# EAGLE design left board (EAGLE 8.6.1)
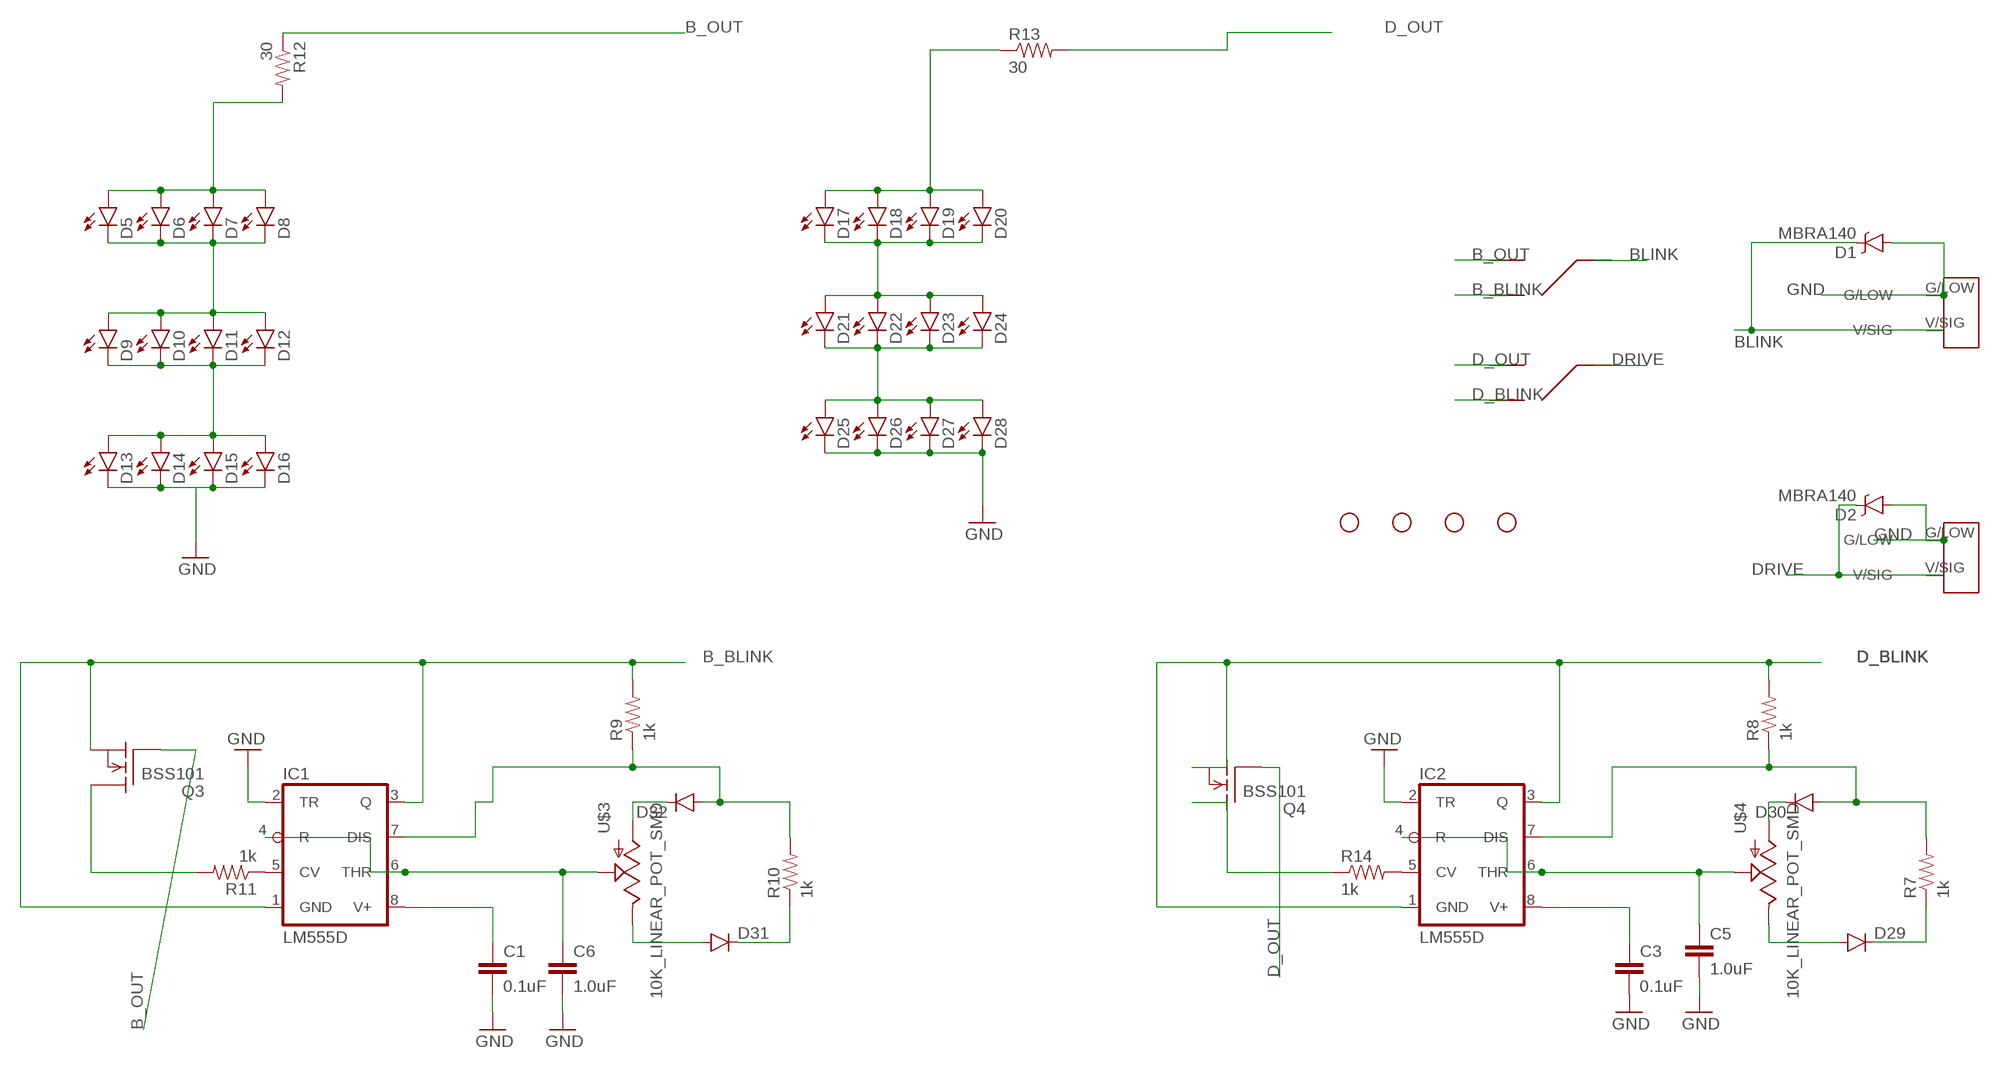
[diagram p0: schematic, sheet 1]

## Parts
C1  0.1uF  0.1UF-25V(+80/-20%)(0603)  [0603-CAP]
C3  0.1uF  0.1UF-25V(+80/-20%)(0603)  [0603-CAP]
C5  1.0uF  1.0UF-25V-+80/-20(0805)"  [0805-CAP]
C6  1.0uF  1.0UF-25V-+80/-20(0805)"  [0805-CAP]
D1  MBRA140  [SMA-DIODE]
D2  MBRA140  [SMA-DIODE]
D5  LED5MM  [LED5MM]
D6  LED5MM  [LED5MM]
D7  LED5MM  [LED5MM]
D8  LED5MM  [LED5MM]
D9  LED5MM  [LED5MM]
D10  LED5MM  [LED5MM]
D11  LED5MM  [LED5MM]
D12  LED5MM  [LED5MM]
D13  LED5MM  [LED5MM]
D14  LED5MM  [LED5MM]
D15  LED5MM  [LED5MM]
D16  LED5MM  [LED5MM]
D17  LED5MM  [LED5MM]
D18  LED5MM  [LED5MM]
D19  LED5MM  [LED5MM]
D20  LED5MM  [LED5MM]
D21  LED5MM  [LED5MM]
D22  LED5MM  [LED5MM]
D23  LED5MM  [LED5MM]
D24  LED5MM  [LED5MM]
D25  LED5MM  [LED5MM]
D26  LED5MM  [LED5MM]
D27  LED5MM  [LED5MM]
D28  LED5MM  [LED5MM]
D29  DIODESMA  [SMA-DIODE]
D30  DIODESMA  [SMA-DIODE]
D31  DIODESMA  [SMA-DIODE]
D32  DIODESMA  [SMA-DIODE]
H1  STAND-OFF  [STAND-OFF]
H2  STAND-OFF  [STAND-OFF]
H3  STAND-OFF  [STAND-OFF]
H4  STAND-OFF  [STAND-OFF]
IC1  LM555D  [SO08]
IC2  LM555D  [SO08]
Q3  BSS101  [TO92]
Q4  BSS101  [TO92]
R7  1k  0.22OHM-1/4W-1%(0805)  [0805]
R8  1k  0.22OHM-1/4W-1%(0805)  [0805]
R9  1k  0.22OHM-1/4W-1%(0805)  [0805]
R10  1k  0.22OHM-1/4W-1%(0805)  [0805]
R11  1k  0.22OHM-1/4W-1%(0805)  [0805]
R12  30  0.22OHM-1/4W-1%(0805)  [0805]
R13  30  0.22OHM-1/4W-1%(0805)  [0805]
R14  1k  0.22OHM-1/4W-1%(0805)  [0805]
U$1  JS_SERIES_SLIDESWITCCH  [MYPART3]
U$2  JS_SERIES_SLIDESWITCCH  [MYPART3]
U$3  10K_LINEAR_POT_SMD  [TC33X]
U$4  10K_LINEAR_POT_SMD  [TC33X]
U$5  2_PIN_TECONNECTOR  [2_PIN_CONNECT]
U$7  2_PIN_TECONNECTOR  [2_PIN_CONNECT]

## Nets
B_BLINK: IC1.1(GND) IC1.3(Q) Q3.1(S) R9.2 U$1.OUT1
B_OUT: Q3.2(G) R12.1 U$1.OUT2
BLINK: D1.C U$1.IN U$7.V/SIG
D_BLINK: IC2.1(GND) IC2.3(Q) Q4.1(S) R8.2 U$2.OUT1
D_OUT: Q4.2(G) R13.2 U$2.OUT2
DRIVE: D2.C U$2.IN U$5.V/SIG
GND: C1.2 C3.2 C5.2 C6.2 D1.A D2.A D13.K(C) D14.K(C) D15.K(C) D16.K(C) D25.K(C) D26.K(C) D27.K(C) D28.K(C) IC1.2(TR) IC2.2(TR) U$5.G/LOW U$7.G/LOW
N$1: Q3.3(D) R11.2
N$2: D32.C U$3.1(A)
N$3: C6.1 IC1.4(R) IC1.6(THR) U$3.2(S)
N$4: D32.A IC1.7(DIS) R9.1 R10.2
N$5: D31.A U$3.3(E)
N$6: C1.1 IC1.8(V+)
N$7: D31.C R10.1
N$8: IC2.5(CV) R14.2
N$9: D30.C U$4.1(A)
N$10: IC1.5(CV) R11.1
N$11: Q4.3(D) R14.1
N$12: D5.K(C) D6.K(C) D7.K(C) D8.K(C) D9.A D10.A D11.A D12.A
N$13: C5.1 IC2.4(R) IC2.6(THR) U$4.2(S)
N$14: D30.A IC2.7(DIS) R7.2 R8.1
N$15: C3.1 IC2.8(V+)
N$16: D5.A D6.A D7.A D8.A R12.2
N$17: D29.A U$4.3(E)
N$18: D29.C R7.1
N$19: D17.A D18.A D19.A D20.A R13.1
N$21: D9.K(C) D10.K(C) D11.K(C) D12.K(C) D13.A D14.A D15.A D16.A
N$22: D21.K(C) D22.K(C) D23.K(C) D24.K(C) D25.A D26.A D27.A D28.A
N$23: D17.K(C) D18.K(C) D19.K(C) D20.K(C) D21.A D22.A D23.A D24.A

## Library data of the parts
C1 C3 = SparkFun-Capacitors-extra:0.1UF-25V(+80/-20%)(0603): CAP-00810 Ceramic Standard decoupling cap; PROD_ID: CAP-00810
C5 C6 = SparkFun-Capacitors-extra:1.0UF-25V-+80/-20(0805): CAP-11625; PROD_ID: CAP-11625
D1 D2 = SparkFun-DiscreteSemi:MBRA140: 40V, 1A Schottky rectifier SMA/DO-214AC package DIO-08053; PROD_ID: DIO-08053
D5-D28 = SparkFun-LED:LED: LEDs Standard schematic elements and footprints for 5mm, 3mm, 1206, and 0603 sized LEDs. 5mm - Spark Fun Electronics SKU : COM-00529 (and others)
D29-D32 = SparkFun-DiscreteSemi:DIODE: Diode These are standard reverse protection diodes and small signal diodes. SMA package can handle up to about 1A. SOD-323 can handle about 200mA. What the SOD-323 package when ordering, there are some mfgs out there that are 5-pin packages.
H1-H4 = SparkFun-Electromechanical:STAND-OFF: #4 Stand Off This is the mechanical footprint for a #4 phillips button head screw. Use the keepout ring to avoid running the screw head into surrounding components. SKU : PRT-00447
IC1 IC2 = linear:*555: TIMER
Q3 Q4 = transistor-fet:BSS101: N-Channel Enhancement MOSFET 200V; 0,16A; 11Ohm
R7-R14 = SparkFun-Resistors:0.22OHM-1/4W-1%(0805): RES-09883; PROD_ID: RES-09883; VALUE: 0.22
U$1 U$2 = slide switch:JS_SERIES_SLIDESWITCCH: ON-ON 12V Sliding switch
U$3 U$4 = SparkFun-Resistors:10K_LINEAR_POT_SMD; PROD_ID: RES-12428
U$5 U$7 = TE 2-pin connector:2_PIN_TECONNECTOR: 2-pin connector for high power connections on board

## Board
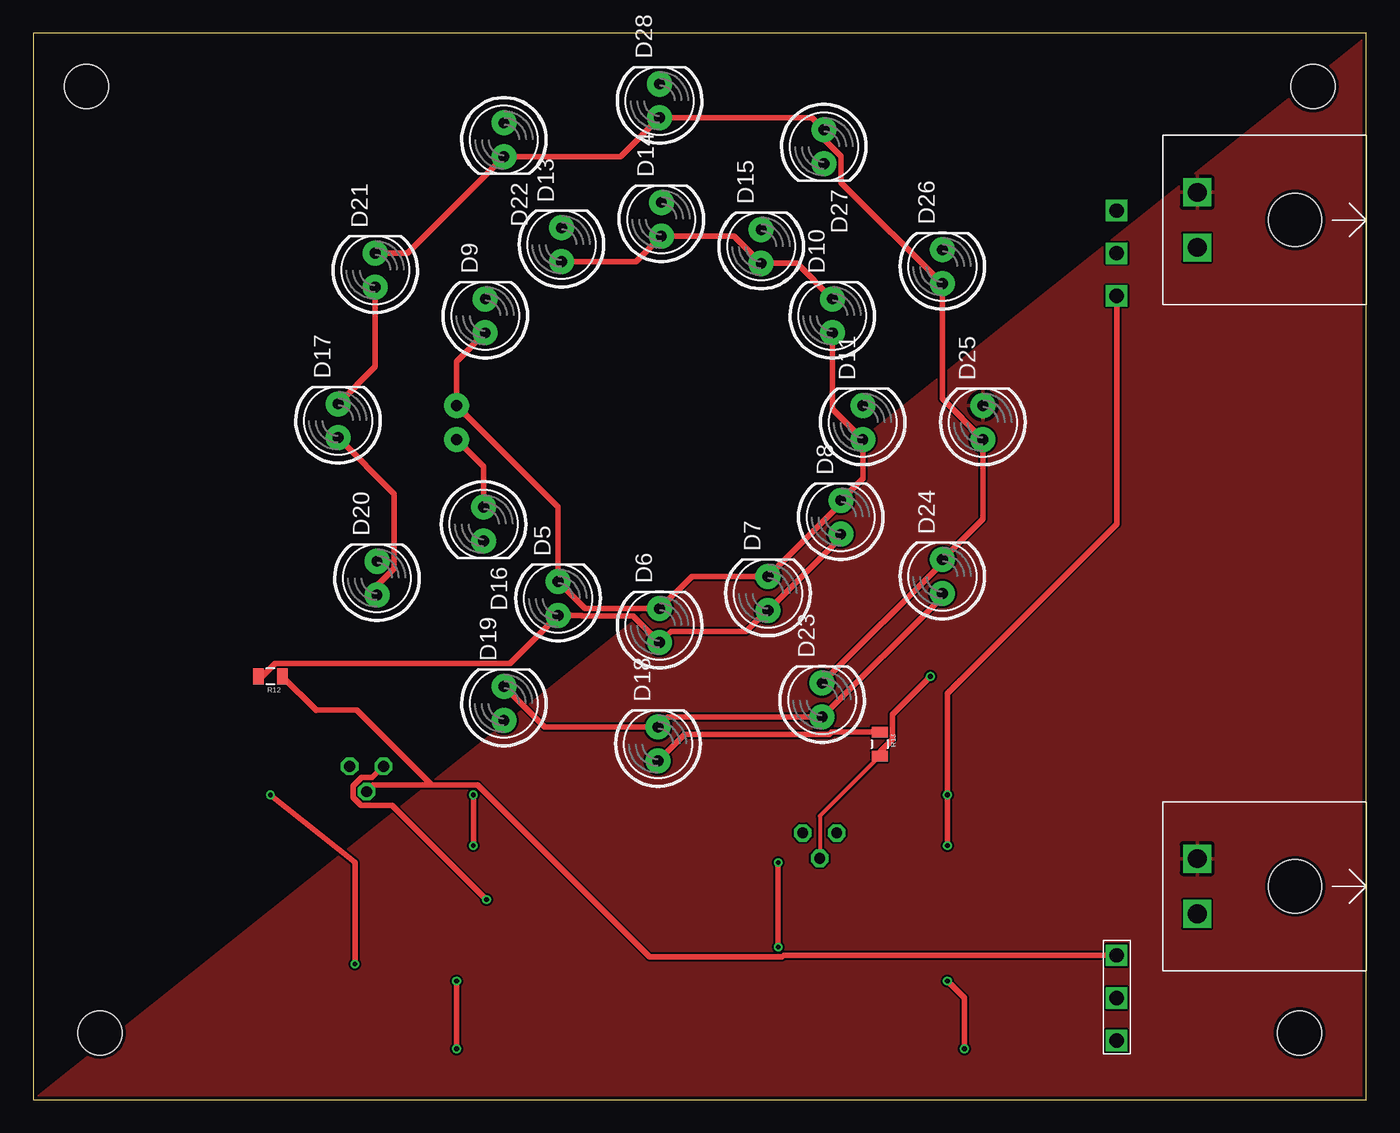
[diagram p1: board, top side]
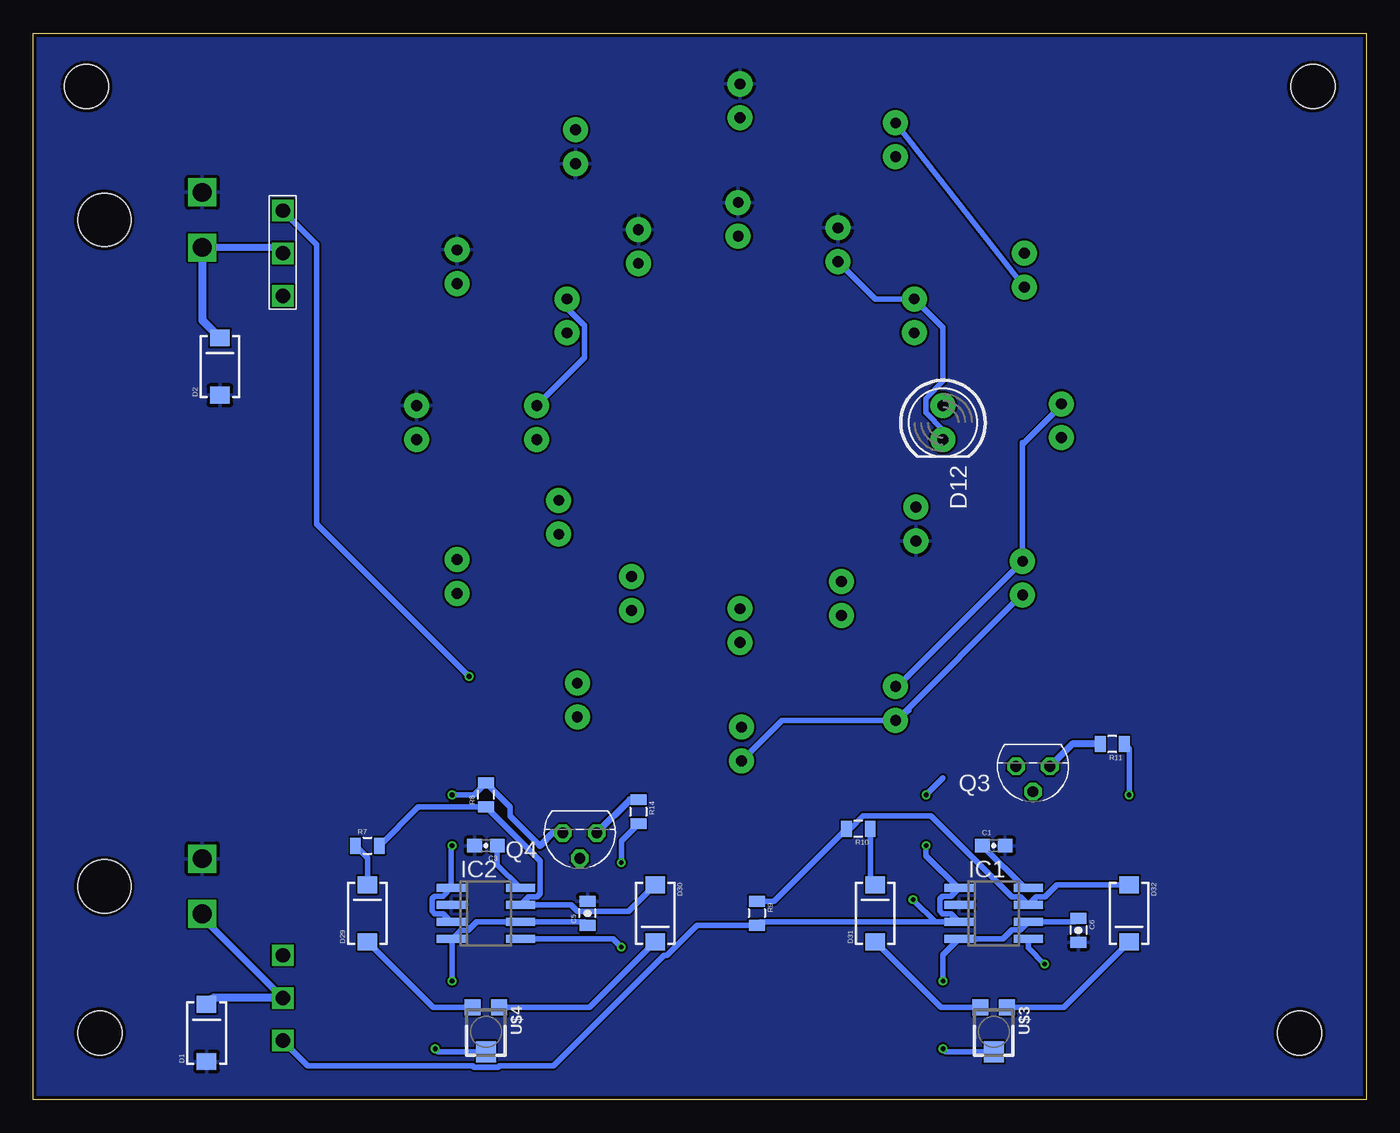
[diagram p2: board, bottom side, seen from below]

Size 100 x 80 mm. Coordinates in mm from the lower left corner, seen from the top.
Outline: 0,0 100,0 100,80 0,80 0,0
Copper layers (1*16): Top 0.035mm / dielectric 1.5mm / Bottom 0.035mm
Design rules "SeeedStudio_2layer_DRU_no_angle_20140221": minimum track width 6mil, minimum drill 12mil, track to track 6mil, track to pad 6mil, pad to pad 6mil, via to via 6mil, smd to smd 0mil, copper to edge 10mil, drill to drill 10mil, minimum pad ring 10mil, minimum via ring 6mil, stop-mask expansion 2mil, vias tented up to drill 100mil, thermal gap 10mil

### Footprints (pad centres in the part's own frame; a part is rotated, then mirrored left to right if it is on the bottom)
0603-CAP = smd 1.1 x 1: 1 -0.85,0; 2 0.85,0
0805-CAP = smd 0.8 x 1.2: 1 -0.9,0; 2 0.9,0
SMA-DIODE = smd 1.27 x 1.47: A -2.15,0; C 2.15,0
LED5MM = drill 0.813 pad 1.88: A -1.27,0; K 1.27,0
STAND-OFF = hole 3.302: 0,0
SO08 = smd 0.6 x 2.2: 1 -1.905,-2.6; 2 -0.635,-2.6; 3 0.635,-2.6; 4 1.905,-2.6; 5 1.905,2.6; 6 0.635,2.6; 7 -0.635,2.6; 8 -1.905,2.6
TO92 = drill 0.813 octagon: 1 1.27,0; 2 0,1.905; 3 -1.27,0
0805 = smd 0.8 x 1.2: 1 -0.9,0; 2 0.9,0
MYPART3 = drill 1.067 square: IN 0,0; OUT1 -3.2,0; OUT2 3.2,0
TC33X = smd 1.2 x 1.2: 1 -1,-1.825; 3 1,-1.825 | smd 1.5 x 1.6: 2 0,1.5
2_PIN_CONNECT = drill 1.4 square: G/LOW 2.07,12.67; V/SIG -2.07,12.67 | hole 4: 0,5.33

### Placement (x,y rotation side)
C1  27.94,19.05 0 bottom
C3  66.04,19.05 180 bottom
C5  58.42,13.97 90 bottom
C6  21.59,12.7 270 bottom
D1  87,5 90 bottom
D2  86,55 90 bottom
D5  39.37,37.59 90 top
D6  46.99,35.56 90 top
D7  55.12,37.97 90 top
D8  60.58,43.69 90 top
D9  33.91,58.8 90 top
D10  59.94,58.8 90 top
D11  62.23,50.8 90 top
D12  31.75,50.8 270 bottom
D13  39.62,64.14 90 top
D14  47.12,66.04 90 top
D15  54.61,64.01 90 top
D16  33.78,43.18 270 top
D17  22.86,50.93 90 top
D18  46.86,26.67 90 top
D19  35.31,29.72 90 top
D20  25.78,39.12 90 top
D21  25.65,62.23 90 top
D22  35.31,72.01 270 top
D23  59.18,29.97 90 top
D24  68.2,39.24 90 top
D25  71.25,50.8 90 top
D26  68.2,62.48 90 top
D27  59.31,71.5 270 top
D28  46.99,74.93 90 top
D29  74.93,13.97 90 bottom
D30  53.34,13.97 270 bottom
D31  36.83,13.97 90 bottom
D32  17.78,13.97 270 bottom
H1  5,5 0 top
H2  95,5 0 top
H3  4,76 0 top
H4  96,76 0 top
IC1  27.94,13.97 270 bottom
IC2  66.04,13.97 270 bottom
Q3  25,25 180 bottom
Q4  59,20 180 bottom
R7  74.93,19.05 0 bottom
R8  66.04,22.86 90 bottom
R9  45.72,13.97 270 bottom
R10  38.1,20.32 180 bottom
R11  19.05,26.67 180 bottom
R12  17.78,31.75 180 top
R13  63.5,26.67 270 top
R14  54.61,21.59 270 bottom
U$1  81.28,7.62 90 top
U$2  81.28,63.5 90 bottom
U$3  27.94,5.08 180 bottom
U$4  66.04,5.08 180 bottom
U$5  100,66 90 top
U$7  100,16 90 top

### Tracks (layer width: path | path; a pad name or v marks a point on that pad's centre or on a via)
B_BLINK  (via drill 0.35)
  Top 0.406: v33.02,22.86 v33.02,19.05 | Q3.1 25.42,24.15 24.62,24.15 23.98,23.52 23.98,22.67 24.58,22.08 26.92,22.08 v34,15
  Bottom 0.406: IC1.3 45.45,13.34 R9.2 50.22,13.07 52.46,10.83 52.67,10.83 60.96,2.54 65.03,2.54 65.14,2.42 66.94,2.42 67.05,2.54 79.4,2.54 U$1.OUT1 | IC1.3 31.15,13.95 31.79,13.95 32,14.16 32,15.05 31.79,15.26 31.15,15.26 30.57,15.84 | 30.57,15.84 IC1.1 | v33.02,19.05 33.02,18.29 30.57,15.84 | 31.75,24.13 v33.02,22.86 | IC1.3 32.34,13.34 v34,15
B_OUT
  Top 0.406: U$1.OUT2 56.31,10.82 56.18,10.7 46.22,10.7 33.32,23.59 29.89,23.59 | 21.22,29.21 21.21,29.21 | 21.21,29.21 R12.1 | Q3.2 25.5,23.59 29.89,23.59 | 21.21,29.21 24.27,29.21 29.89,23.59
BLINK
  Bottom 0.508: U$1.IN 87.33,13.67 U$7.V/SIG
  Bottom 0.61: 81.46,7.62 U$1.IN 86.53,7.62 D1.C
D_BLINK  (via drill 0.35)
  Top 0.406: v68.58,19.05 v68.58,22.86 68.58,30.48 81.28,43.18 U$2.OUT1
  Bottom 0.406: IC2.3 69.25,13.95 69.89,13.95 70.1,14.16 70.1,15.05 69.89,15.26 69.25,15.26 IC2.1 68.64,18.99 v68.58,19.05 | v68.58,22.86 66.94,22.86 R8.2 64.23,21.95 64.23,21.29 62,19.05
  Bottom 0.508: Q4.1 61.05,20 62,19.05
D_OUT  (via drill 0.35)
  Top 0.305: R13.2 59,21.27 Q4.2
  Top 0.406: R13.2 63.5,26.07 64.46,27.02 64.46,28.9 v67.31,31.75
  Bottom 0.406: v67.31,31.75 78.74,43.18 78.74,64.16 U$2.OUT2
DRIVE
  Bottom 0.508: U$2.IN 81.71,63.93 U$5.V/SIG
  Bottom 0.61: U$5.V/SIG 87.33,58.48 D2.C
GND
  pour Top: 100.33,80.01 100.33,0 0,0
  pour Bottom: 0,80.01 100.33,80.01 100.33,0 0,0
N$1
  Bottom 0.508: R11.2 22.06,26.67 Q3.3
N$2
  Bottom 0.406: U$3.1 22.7,6.91 D32.C
N$3  (via drill 0.35)
  Top 0.406: v31.75,3.81 v31.75,8.89
  Bottom 0.406: U$3.2 31.52,3.58 v31.75,3.81 | v31.75,8.89 31.75,10.86 IC1.4 27.24,12.06 26.59,12.72 25.95,12.72 IC1.6 21.86,13.34 C6.1
N$4
  Bottom 0.406: D32.A 23.19,16.12 24.09,15.22 24.73,15.22 IC1.7 25.95,15.22 26.59,15.22 32.64,21.28 37.75,21.28 38.7,20.32 R10.2 44.45,14.87 R9.1
N$5
  Bottom 0.406: U$3.3 31.91,6.91 D31.A
N$6
  Bottom 0.406: IC1.8 25.61,15.88 C1.1
N$7
  Bottom 0.406: R10.1 37.2,16.49 D31.C
N$8  (via drill 0.35)
  Top 0.406: v55.88,11.43 v55.88,17.78
  Bottom 0.406: IC2.5 56.52,12.06 v55.88,11.43 | v55.88,17.78 55.88,19.42 R14.2
N$9
  Bottom 0.406: U$4.1 58.26,6.91 D30.C
N$10  (via drill 0.35)
  Top 0.406: v24.13,10.16 24.13,17.78 v17.78,22.86
  Bottom 0.406: IC1.5 25.34,11.37 v24.13,10.16 | v17.78,22.86 17.78,26.3 R11.1
N$11
  Bottom 0.406: 54.81,22.69 R14.1
  Bottom 0.508: R14.1 55.24,22.49 Q4.3
N$12
  Top 0.406: D10.A 59.94,51.82 D11.A 62.23,46.61 D8.K 60.58,44.7 D7.K 49.4,39.24 D6.K 41.4,36.83 D5.K 39.37,44.45 D12.A 31.75,55.37 D9.A
N$13  (via drill 0.35)
  Top 0.406: v69.85,3.81 69.85,7.62 v68.58,8.89
  Bottom 0.406: U$4.2 69.62,3.58 v69.85,3.81 | 68.58,12.01 v68.58,8.89 | 68.58,12.01 IC2.4 | C5.1 58.69,13.34 IC2.6 66.74,13.34 67.39,12.68 67.91,12.68 68.58,12.01
N$14
  Bottom 0.406: R7.2 71.12,21.96 R8.1 61.98,17.9 61.98,15.43 62.19,15.22 62.83,15.22 IC2.7 59.66,14.61 59.17,14.11 55.35,14.11 D30.A
N$15
  Bottom 0.406: C3.1 65.19,17.62 IC2.8
N$16
  Top 0.406: D8.A 60.58,42.16 D7.A 55.06,36.7 53.48,35.13 47.83,35.13 D6.A 45.01,36.27 41.17,36.27 41.12,36.32 D5.A 35.75,32.71 18.13,32.71 17.18,31.75 R12.2
N$17
  Bottom 0.406: U$4.3 70.02,6.91 D29.A
N$18
  Bottom 0.406: D29.C 74.93,18.15 R7.1
N$19
  Top 0.406: D20.A 25.78,38.55 27.08,39.85 27.08,45.44 D17.A | R13.1 59.88,27.57 59.72,27.41 48.87,27.41 D18.A
  Bottom 0.406: 35.09,28.61 D19.A 43.81,28.45 D18.A | 35.09,28.61 34.29,29.21 | D20.A 25.85,37.85 35.09,28.61
N$21
  Top 0.406: D13.A 45.21,62.87 D14.A 52.58,64.77 D15.A 57.28,62.74 D10.K | D16.A 33.78,47.5 D12.K
  Bottom 0.406: D10.K 59.94,59.36 58.65,58.07 58.65,55.65 D11.K | D12.K 31.75,50.24 33.05,51.53 33.05,52.61 31.75,53.9 31.75,57.91 D9.K 36.83,60.07 D13.A
N$22
  Top 0.406: D23.K 68.2,40.26 D24.K 71.25,43.56 D25.A 68.2,52.58 D26.A 60.6,68.81 60.6,70.77 59.31,72.06 D27.A 58.42,73.66 D28.A 44.07,70.74 D22.K 28.07,63.5 D21.K
N$23
  Top 0.406: D24.A 68.2,37.72 D23.A 47.62,28.7 D18.K 38.35,27.94 D19.K | D21.A 25.65,54.99 D17.K
  Bottom 0.406: D21.A D22.A | D19.K 35.18,30.99 D20.K 25.78,49.14 | 25.78,49.14 25.78,49.28 | D17.K 22.86,52.06 25.78,49.14